# EAGLE design envca_4hp_2v (EAGLE 7.7.0)
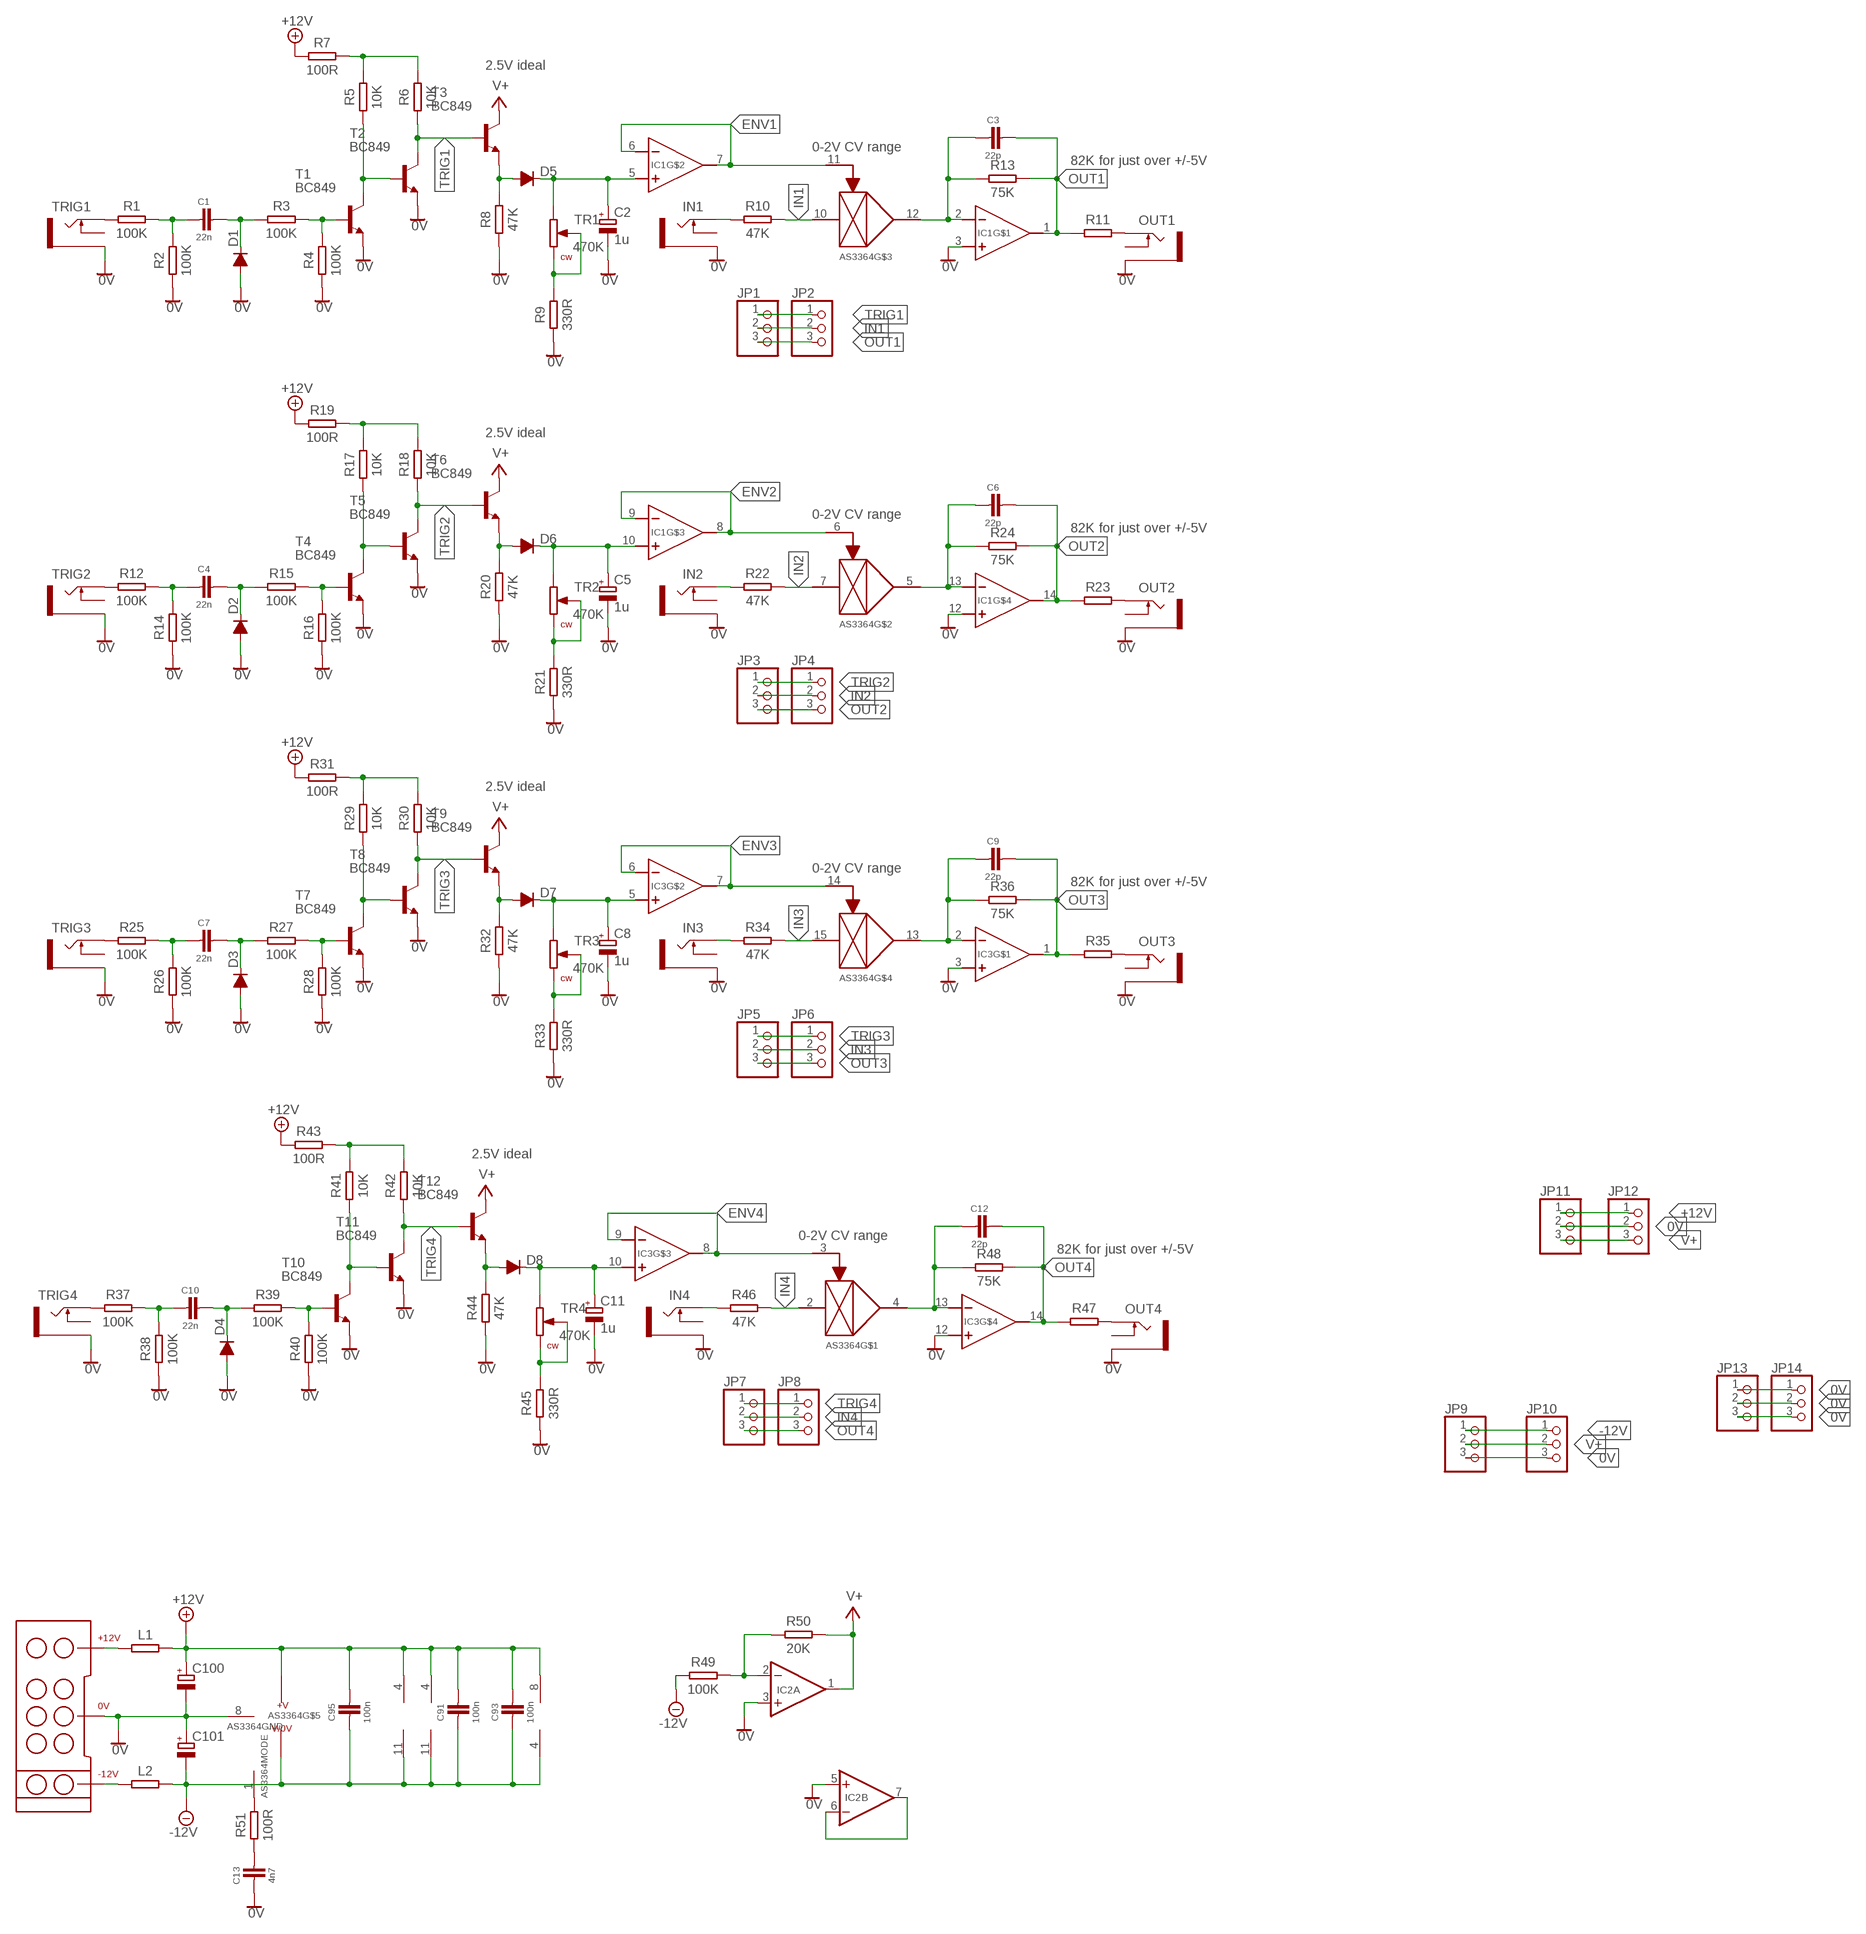
[diagram p0: schematic, sheet 1]

## Parts
AS3364  AS2164_SMD  [SO16]
C1  22n  CAP_0805  [C0805]
C2  1u  CPOL-EUE2.5-6  [E2,5-6]
C3  22p  CAP_0805  [C0805]
C4  22n  CAP_0805  [C0805]
C5  1u  CPOL-EUE2.5-6  [E2,5-6]
C6  22p  CAP_0805  [C0805]
C7  22n  CAP_0805  [C0805]
C8  1u  CPOL-EUE2.5-6  [E2,5-6]
C9  22p  CAP_0805  [C0805]
C10  22n  CAP_0805  [C0805]
C11  1u  CPOL-EUE2.5-6  [E2,5-6]
C12  22p  CAP_0805  [C0805]
C13  4n7  CAP_0805  [C0805]
C91  100n  CAP_0805  [C0805]
C93  100n  CAP_0805  [C0805]
C95  100n  CAP_0805  [C0805]
C100  CPOL-EUE2.5-6  [E2,5-6]
C101  CPOL-EUE2.5-6  [E2,5-6]
D1  DIODE-SOD123  [SOD123]
D2  DIODE-SOD123  [SOD123]
D3  DIODE-SOD123  [SOD123]
D4  DIODE-SOD123  [SOD123]
D5  DIODE-SOD123  [SOD123]
D6  DIODE-SOD123  [SOD123]
D7  DIODE-SOD123  [SOD123]
D8  DIODE-SOD123  [SOD123]
IC1  TL074_SO14  [SO14]
IC2  TL072_SMDD  [SO08]
IC3  TL074_SO14  [SO14]
IN1  THONKICONN  [THONKICONN]
IN2  THONKICONN  [THONKICONN]
IN3  THONKICONN  [THONKICONN]
IN4  THONKICONN  [THONKICONN]
JP1  PINHD-1X3  [1X03]
JP2  PINHD-1X3  [1X03]
JP3  PINHD-1X3  [1X03]
JP4  PINHD-1X3  [1X03]
JP5  PINHD-1X3  [1X03]
JP6  PINHD-1X3  [1X03]
JP7  PINHD-1X3  [1X03]
JP8  PINHD-1X3  [1X03]
JP9  PINHD-1X3  [1X03]
JP10  PINHD-1X3  [1X03]
JP11  PINHD-1X3  [1X03]
JP12  PINHD-1X3  [1X03]
JP13  PINHD-1X3  [1X03]
JP14  PINHD-1X3  [1X03]
L1  RESISTOR_0805  [R0805]
L2  RESISTOR_0805  [R0805]
OUT1  THONKICONN  [THONKICONN]
OUT2  THONKICONN  [THONKICONN]
OUT3  THONKICONN  [THONKICONN]
OUT4  THONKICONN  [THONKICONN]
R1  100K  RESISTOR_0805  [R0805]
R2  100K  RESISTOR_0805  [R0805]
R3  100K  RESISTOR_0805  [R0805]
R4  100K  RESISTOR_0805  [R0805]
R5  10K  RESISTOR_0805  [R0805]
R6  10K  RESISTOR_0805  [R0805]
R7  100R  RESISTOR_0805  [R0805]
R8  47K  RESISTOR_0805  [R0805]
R9  330R  RESISTOR_0805  [R0805]
R10  47K  RESISTOR_0805  [R0805]
R11  RESISTOR_0805  [R0805]
R12  100K  RESISTOR_0805  [R0805]
R13  75K  RESISTOR_0805  [R0805]
R14  100K  RESISTOR_0805  [R0805]
R15  100K  RESISTOR_0805  [R0805]
R16  100K  RESISTOR_0805  [R0805]
R17  10K  RESISTOR_0805  [R0805]
R18  10K  RESISTOR_0805  [R0805]
R19  100R  RESISTOR_0805  [R0805]
R20  47K  RESISTOR_0805  [R0805]
R21  330R  RESISTOR_0805  [R0805]
R22  47K  RESISTOR_0805  [R0805]
R23  RESISTOR_0805  [R0805]
R24  75K  RESISTOR_0805  [R0805]
R25  100K  RESISTOR_0805  [R0805]
R26  100K  RESISTOR_0805  [R0805]
R27  100K  RESISTOR_0805  [R0805]
R28  100K  RESISTOR_0805  [R0805]
R29  10K  RESISTOR_0805  [R0805]
R30  10K  RESISTOR_0805  [R0805]
R31  100R  RESISTOR_0805  [R0805]
R32  47K  RESISTOR_0805  [R0805]
R33  330R  RESISTOR_0805  [R0805]
R34  47K  RESISTOR_0805  [R0805]
R35  RESISTOR_0805  [R0805]
R36  75K  RESISTOR_0805  [R0805]
R37  100K  RESISTOR_0805  [R0805]
R38  100K  RESISTOR_0805  [R0805]
R39  100K  RESISTOR_0805  [R0805]
R40  100K  RESISTOR_0805  [R0805]
R41  10K  RESISTOR_0805  [R0805]
R42  10K  RESISTOR_0805  [R0805]
R43  100R  RESISTOR_0805  [R0805]
R44  47K  RESISTOR_0805  [R0805]
R45  330R  RESISTOR_0805  [R0805]
R46  47K  RESISTOR_0805  [R0805]
R47  RESISTOR_0805  [R0805]
R48  75K  RESISTOR_0805  [R0805]
R49  100K  RESISTOR_0805  [R0805]
R50  20K  RESISTOR_0805  [R0805]
R51  100R  RESISTOR_0805  [R0805]
T1  BC849  [SOT23]
T2  BC849  [SOT23]
T3  BC849  [SOT23]
T4  BC849  [SOT23]
T5  BC849  [SOT23]
T6  BC849  [SOT23]
T7  BC849  [SOT23]
T8  BC849  [SOT23]
T9  BC849  [SOT23]
T10  BC849  [SOT23]
T11  BC849  [SOT23]
T12  BC849  [SOT23]
TR1  470K  TRIMMER-3362  [TRIMMER3362]
TR2  470K  TRIMMER-3362  [TRIMMER3362]
TR3  470K  TRIMMER-3362  [TRIMMER3362]
TR4  470K  TRIMMER-3362  [TRIMMER3362]
TRIG1  THONKICONN  [THONKICONN]
TRIG2  THONKICONN  [THONKICONN]
TRIG3  THONKICONN  [THONKICONN]
TRIG4  THONKICONN  [THONKICONN]
U$1  EURO_POWER  [EURO_POWER]

## Nets
0V: AS3364.8 C2.- C5.- C8.- C11.- C13.1 C100.- C101.+ D1.A D2.A D3.A D4.A IC1.3(+) IC1.12(+) IC2.3(A:+IN) IC2.5(B:+IN) IC3.3(+) IC3.12(+) IN1.P$3_SLEEVE(SLEEVE) IN2.P$3_SLEEVE(SLEEVE) IN3.P$3_SLEEVE(SLEEVE) IN4.P$3_SLEEVE(SLEEVE) JP9.3 JP10.3 JP11.2 JP12.2 JP13.1 JP13.2 JP13.3 JP14.1 JP14.2 JP14.3 OUT1.P$3_SLEEVE(SLEEVE) OUT2.P$3_SLEEVE(SLEEVE) OUT3.P$3_SLEEVE(SLEEVE) OUT4.P$3_SLEEVE(SLEEVE) R2.1 R4.1 R8.1 R9.1 R14.1 R16.1 R20.1 R21.1 R26.1 R28.1 R32.1 R33.1 R38.1 R40.1 R44.1 R45.1 T1.2(E) T2.2(E) T4.2(E) T5.2(E) T7.2(E) T8.2(E) T10.2(E) T11.2(E) TRIG1.P$3_SLEEVE(SLEEVE) TRIG2.P$3_SLEEVE(SLEEVE) TRIG3.P$3_SLEEVE(SLEEVE) TRIG4.P$3_SLEEVE(SLEEVE) U$1.3(0V) U$1.4(0V) U$1.5(0V) U$1.6(0V) U$1.7(0V) U$1.8(0V)
+12V: AS3364.16(VDD) C91.2 C93.2 C95.2 C100.+ IC1.4(V+) IC2.8(P:V+) IC3.4(V+) JP11.1 JP12.1 L1.2 R7.1 R19.1 R31.1 R43.1
-12V: AS3364.9(VSS) C91.1 C93.1 C95.1 C101.- IC1.11(V-) IC2.4(P:V-) IC3.11(V-) JP9.1 JP10.1 L2.2 R49.1
ENV1: AS3364.11(VC) IC1.6(-) IC1.7(OUT)
ENV2: AS3364.6(VC) IC1.8(OUT) IC1.9(-)
ENV3: AS3364.14(VC) IC3.6(-) IC3.7(OUT)
ENV4: AS3364.3(VC) IC3.8(OUT) IC3.9(-)
IN1: AS3364.10(IN) JP1.2 JP2.2 R10.2
IN2: AS3364.7(IN) JP3.2 JP4.2 R22.2
IN3: AS3364.15(IN) JP5.2 JP6.2 R34.2
IN4: AS3364.2(IN) JP7.2 JP8.2 R46.2
N$1: L1.1 U$1.9(+12V) U$1.10(+12V)
N$2: L2.1 U$1.1(-12V) U$1.2(-12V)
N$3: IN1.P$1_TIP(TIP) R10.1
N$4: C2.+ D5.C IC1.5(+) TR1.P$1
N$5: R5.1 T1.3(C) T2.1(B)
N$6: C1.2 D1.C R3.1
N$7: R3.2 R4.2 T1.1(B)
N$8: C1.1 R1.2 R2.2
N$9: R5.2 R6.2 R7.2
N$10: R9.2 TR1.P$2A TR1.P$2B TR1.P$3
N$11: OUT1.P$1_TIP(TIP) R11.2
N$12: R1.1 TRIG1.P$1_TIP(TIP)
N$13: C5.+ D6.C IC1.10(+) TR2.P$1
N$14: AS3364.12(OUT) C3.1 IC1.2(-) R13.1
N$15: R17.1 T4.3(C) T5.1(B)
N$16: C8.+ D7.C IC3.5(+) TR3.P$1
N$17: C4.2 D2.C R15.1
N$18: R15.2 R16.2 T4.1(B)
N$19: C4.1 R12.2 R14.2
N$20: R17.2 R18.2 R19.2
N$21: R21.2 TR2.P$2A TR2.P$2B TR2.P$3
N$22: R12.1 TRIG2.P$1_TIP(TIP)
N$23: IN2.P$1_TIP(TIP) R22.1
N$24: OUT2.P$1_TIP(TIP) R23.2
N$25: AS3364.5(OUT) C6.1 IC1.13(-) R24.1
N$26: R29.1 T7.3(C) T8.1(B)
N$27: C7.2 D3.C R27.1
N$28: R27.2 R28.2 T7.1(B)
N$29: C7.1 R25.2 R26.2
N$30: R29.2 R30.2 R31.2
N$31: R33.2 TR3.P$2A TR3.P$2B TR3.P$3
N$32: R25.1 TRIG3.P$1_TIP(TIP)
N$33: IN3.P$1_TIP(TIP) R34.1
N$34: OUT3.P$1_TIP(TIP) R35.2
N$35: AS3364.13(OUT) C9.1 IC3.2(-) R36.1
N$36: C11.+ D8.C IC3.10(+) TR4.P$1
N$37: R41.1 T10.3(C) T11.1(B)
N$38: C10.2 D4.C R39.1
N$39: R39.2 R40.2 T10.1(B)
N$40: C10.1 R37.2 R38.2
N$41: R41.2 R42.2 R43.2
N$42: R45.2 TR4.P$2A TR4.P$2B TR4.P$3
N$43: R37.1 TRIG4.P$1_TIP(TIP)
N$44: IN4.P$1_TIP(TIP) R46.1
N$45: OUT4.P$1_TIP(TIP) R47.2
N$46: AS3364.4(OUT) C12.1 IC3.13(-) R48.1
N$47: IC2.2(A:-IN) R49.2 R50.1
N$48: IC2.6(B:-IN) IC2.7(B:OUT)
N$49: D5.A R8.2 T3.2(E)
N$50: D6.A R20.2 T6.2(E)
N$51: D7.A R32.2 T9.2(E)
N$52: D8.A R44.2 T12.2(E)
N$53: AS3364.1 R51.2
N$54: C13.2 R51.1
OUT1: C3.2 IC1.1(OUT) JP1.3 JP2.3 R11.1 R13.2
OUT2: C6.2 IC1.14(OUT) JP3.3 JP4.3 R23.1 R24.2
OUT3: C9.2 IC3.1(OUT) JP5.3 JP6.3 R35.1 R36.2
OUT4: C12.2 IC3.14(OUT) JP7.3 JP8.3 R47.1 R48.2
TRIG1: JP1.1 JP2.1 R6.1 T2.3(C) T3.1(B)
TRIG2: JP3.1 JP4.1 R18.1 T5.3(C) T6.1(B)
TRIG3: JP5.1 JP6.1 R30.1 T8.3(C) T9.1(B)
TRIG4: JP7.1 JP8.1 R42.1 T11.3(C) T12.1(B)
V+: IC2.1(A:OUT) JP9.2 JP10.2 JP11.3 JP12.3 R50.2 T3.3(C) T6.3(C) T9.3(C) T12.3(C)
Unconnected: IN1.P$2_SWITCH(SWITCH) IN2.P$2_SWITCH(SWITCH) IN3.P$2_SWITCH(SWITCH) IN4.P$2_SWITCH(SWITCH) OUT1.P$2_SWITCH(SWITCH) OUT2.P$2_SWITCH(SWITCH) OUT3.P$2_SWITCH(SWITCH) OUT4.P$2_SWITCH(SWITCH) TRIG1.P$2_SWITCH(SWITCH) TRIG2.P$2_SWITCH(SWITCH) TRIG3.P$2_SWITCH(SWITCH) TRIG4.P$2_SWITCH(SWITCH)

## Notes on the sheet
- 2.5V ideal
- 0-2V CV range
- 82K for just over +/-5V
- 2.5V ideal
- 0-2V CV range
- 82K for just over +/-5V
- 2.5V ideal
- 0-2V CV range
- 82K for just over +/-5V
- 2.5V ideal
- 0-2V CV range
- 82K for just over +/-5V

## Library data of the parts
AS3364 = ay_x:AS2164_SMD
C1 C3 C4 C6 C7 C9 C10 C12 C13 C91 C93 C95 = ay_x:CAP_0805
C2 C5 C8 C11 C100 C101 = resistor:CPOL-EU: POLARIZED CAPACITOR, European symbol
D1-D8 = ay_x:DIODE-: DIODE
IC1 IC3 = ay_x:TL074_SO14
IC2 = ay_x:TL072_SMD: OP AMP
IN1-IN4 OUT1-OUT4 TRIG1-TRIG4 = ay_x:THONKICONN
JP1-JP14 = pinhead:PINHD-1X3: PIN HEADER
L1 L2 R1-R51 = ay_x:RESISTOR_0805
T1-T12 = transistor-neu-to92:BC849: NPN TRANSISTOR
TR1-TR4 = ay_x:TRIMMER-3362
U$1 = ay_x:EURO_POWER

## Board
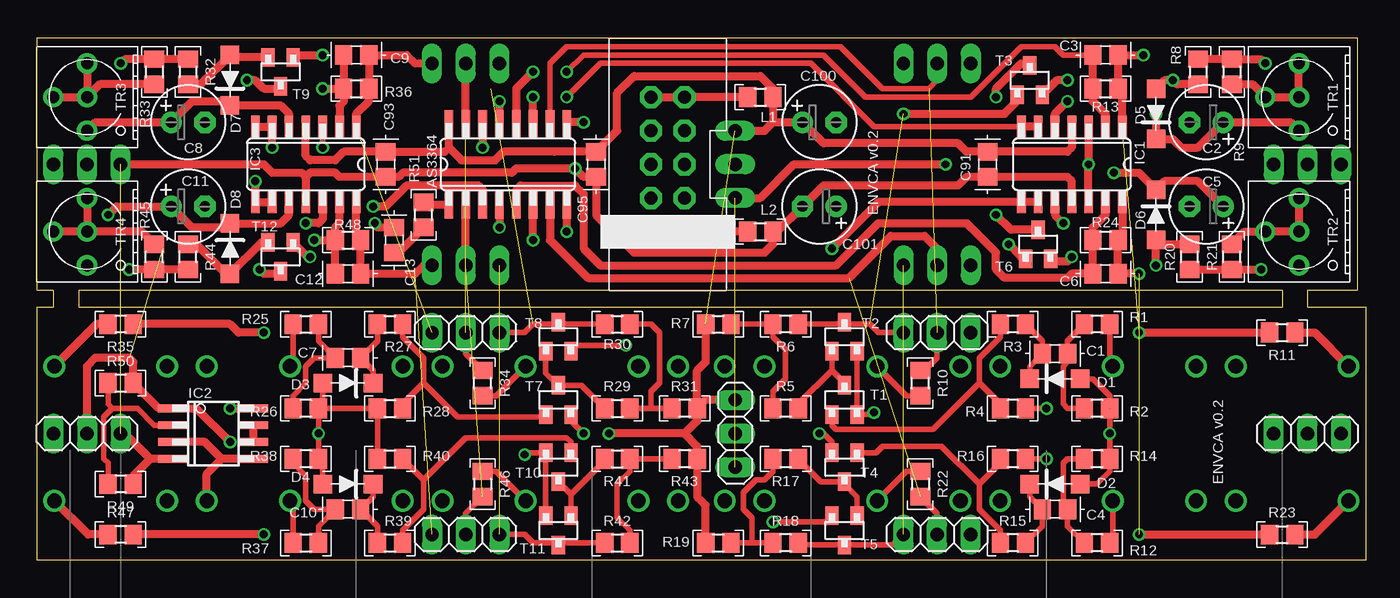
[diagram p1: board, top side]
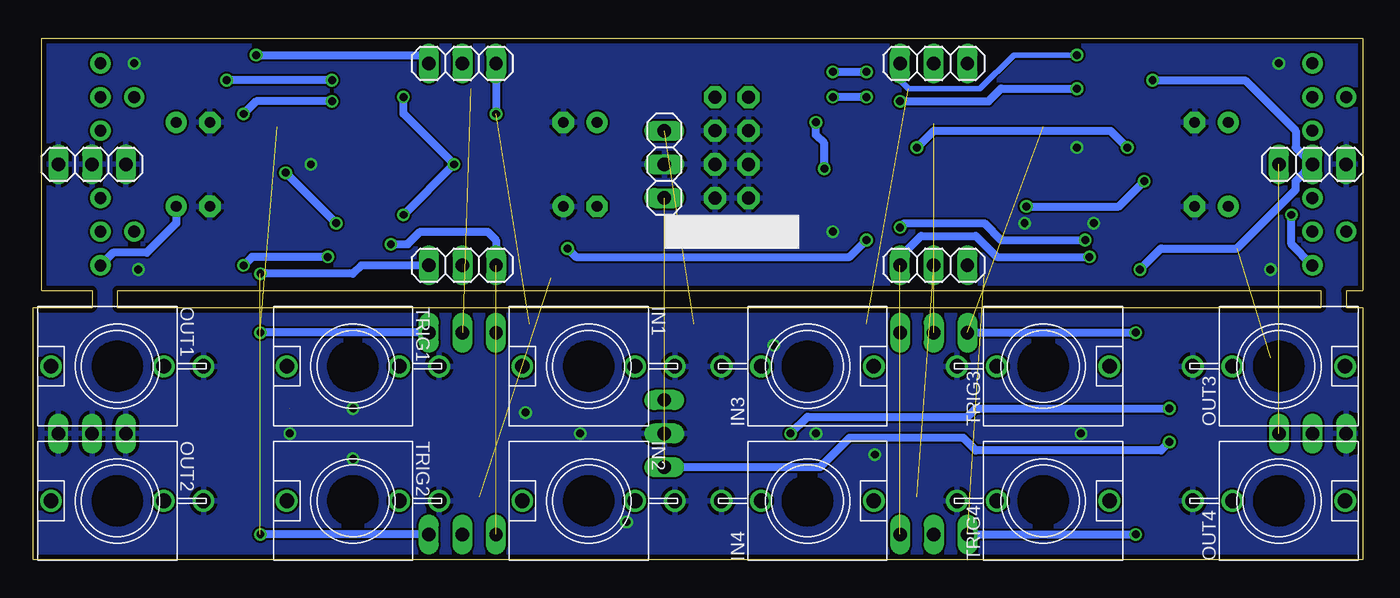
[diagram p2: board, bottom side, seen from below]

Size 100.33 x 39.37 mm. Coordinates in mm from the lower left corner, seen from the top.
Outline: 0,0 100.33,0 100.33,19.05 95.88,19.05 95.88,20.32 99.69,20.32 99.69,39.37 0,39.37 0,20.32 1.27,20.32 1.27,19.05 0,19.05 0,0
Outline: 93.98,19.05 3.17,19.05 3.17,20.32 93.98,20.32 93.98,19.05
Copper layers (1*16): Top 0.0356mm / dielectric 1.5011mm / Bottom 0.0356mm
Design rules "LaenPCBOrder": minimum track width 6mil, minimum drill 13mil, track to track 6mil, track to pad 6mil, pad to pad 6mil, via to via 6mil, smd to smd 6mil, copper to edge 15mil, drill to drill 6mil, minimum pad ring 7mil, minimum via ring 7mil, stop-mask expansion 3mil, vias tented up to drill 0mil, thermal gap 10mil

### Footprints (pad centres in the part's own frame; a part is rotated, then mirrored left to right if it is on the bottom)
SO16 = smd 0.66 x 2.032: 1 -3.81,-3.073; 2 -2.54,-3.073; 3 -1.27,-3.073; 4 0,-3.073; 5 1.27,-3.073; 6 2.54,-3.073; 7 3.81,-3.073; 8 5.08,-3.073; 9 5.08,3.073; 10 3.81,3.073; 11 2.54,3.073; 12 1.27,3.073; 13 0,3.073; 14 -1.27,3.073; 15 -2.54,3.073; 16 -3.81,3.073
C0805 = smd 1.3 x 1.5: 1 -0.95,0; 2 0.95,0
E2,5-6 = drill 0.813 pad 1.6: + -1.27,0 | drill 0.813 pad 1.6 octagon: - 1.27,0
SOD123 = smd 1.4 x 1.4: A 1.9,0; C -1.9,0
SO14 = smd 0.66 x 1.651: 1 -3.81,-2.857; 2 -2.54,-2.857; 3 -1.27,-2.857; 4 0,-2.857; 5 1.27,-2.857; 6 2.54,-2.857; 7 3.81,-2.857; 8 3.81,2.857; 9 2.54,2.857; 10 1.27,2.857; 11 0,2.857; 12 -1.27,2.857; 13 -2.54,2.857; 14 -3.81,2.857
SO08 = smd 0.6 x 2.2: 1 -1.905,-3.048; 2 -0.635,-3.048; 3 0.635,-3.048; 4 1.905,-3.048; 5 1.905,3.048; 6 0.635,3.048; 7 -0.635,3.048; 8 -1.905,3.048
THONKICONN = drill 1.1: P$1_TIP 0,5; P$2_SWITCH 0,-3.5; P$3_SLEEVE 0,-6.5
1X03 = drill 1.016 long: 1 -2.54,0; 2 0,0; 3 2.54,0
R0805 = smd 1.3 x 1.5: 1 -0.95,0; 2 0.95,0
SOT23 = smd 1 x 1.4: 1 -0.95,-1.1; 2 0.95,-1.1; 3 0,1.1
TRIMMER3362 = drill 0.9 pad 1.524: P$1 -2.54,0; P$2A 0,0; P$2B 0,2.54; P$3 2.54,0
EURO_POWER = drill 1 pad 1.676 octagon: 1 -5.08,1.27; 2 -5.08,-1.27; 3 -2.54,1.27; 4 -2.54,-1.27; 5 0,1.27; 6 0,-1.27; 7 2.54,1.27; 8 2.54,-1.27; 9 5.08,1.27; 10 5.08,-1.27

### Placement (x,y rotation side)
AS3364  34.93,29.84 0 top
C1  76.83,15.56 180 top
C2  88.27,33.02 180 top
C3  80.64,38.1 0 top
C4  76.83,3.81 180 top
C5  88.27,26.67 180 top
C6  80.64,21.59 0 top
C7  23.5,15.24 0 top
C8  11.43,33.02 0 top
C9  24.13,38.1 0 top
C10  23.5,3.81 0 top
C11  11.43,26.67 0 top
C12  23.5,21.59 0 top
C13  26.99,24.13 270 top
C91  71.75,29.84 90 top
C93  26.35,29.84 90 top
C95  42.23,29.84 90 top
C100  59.05,33.02 0 top
C101  59.05,26.67 180 top
D1  76.83,13.65 0 top
D2  76.83,5.71 0 top
D3  23.5,13.34 180 top
D4  23.5,5.71 180 top
D5  84.45,33.66 90 top
D6  84.45,26.04 270 top
D7  14.61,36.2 90 top
D8  14.61,23.49 270 top
IC1  78.1,29.84 180 top
IC2  13.33,9.53 270 top
IC3  20.32,29.84 180 top
IN1  58.42,14.61 90 bottom
IN2  58.42,4.45 90 bottom
IN3  41.91,14.61 270 bottom
IN4  41.91,4.45 270 bottom
JP1  67.94,17.14 0 top
JP2  67.94,37.47 180 bottom
JP3  67.94,1.91 0 top
JP4  67.94,22.22 180 bottom
JP5  32.38,17.14 180 top
JP6  32.38,37.47 0 bottom
JP7  32.38,1.91 180 top
JP8  32.38,22.22 0 bottom
JP9  3.81,9.53 180 top
JP10  3.81,29.84 0 bottom
JP11  52.71,9.53 270 top
JP12  52.71,29.84 270 bottom
JP13  95.88,9.53 0 top
JP14  95.88,29.84 180 bottom
L1  54.61,34.93 0 top
L2  54.61,24.76 0 top
OUT1  93.98,14.61 90 bottom
OUT2  93.98,4.45 90 bottom
OUT3  6.35,14.61 270 bottom
OUT4  6.35,4.45 270 bottom
R1  80.01,17.78 180 top
R2  80.01,11.43 180 top
R3  73.66,17.78 180 top
R4  73.66,11.43 180 top
R5  56.52,11.43 180 top
R6  56.52,17.78 180 top
R7  51.44,17.78 0 top
R8  87.63,36.83 270 top
R9  90.17,36.83 270 top
R10  66.67,13.34 90 top
R11  93.98,17.14 0 top
R12  80.01,1.27 180 top
R13  80.64,35.56 0 top
R14  80.01,7.62 180 top
R15  73.66,1.27 180 top
R16  73.66,7.62 180 top
R17  56.52,7.62 180 top
R18  56.52,1.27 180 top
R19  51.44,1.27 0 top
R20  86.99,22.86 90 top
R21  90.17,22.86 90 top
R22  66.67,5.71 270 top
R23  93.98,1.91 0 top
R24  80.64,24.13 0 top
R25  20.32,17.78 0 top
R26  20.32,11.43 180 top
R27  26.67,17.78 0 top
R28  26.67,11.43 0 top
R29  43.82,11.43 0 top
R30  43.82,17.78 0 top
R31  48.9,11.43 180 top
R32  11.43,36.83 270 top
R33  8.89,36.83 270 top
R34  33.66,13.34 90 top
R35  6.35,17.78 180 top
R36  24.13,35.56 0 top
R37  20.32,1.27 0 top
R38  20.32,7.62 180 top
R39  26.67,1.27 0 top
R40  26.67,7.62 0 top
R41  43.82,7.62 0 top
R42  43.82,1.27 0 top
R43  48.9,7.62 180 top
R44  11.43,22.86 90 top
R45  8.89,22.86 90 top
R46  33.66,5.71 270 top
R47  6.35,1.91 180 top
R48  23.5,24.13 0 top
R49  6.35,5.71 180 top
R50  6.35,13.34 0 top
R51  29.21,26.04 90 top
T1  60.96,12.06 0 top
T2  60.96,16.83 0 top
T3  74.93,36.2 0 top
T4  60.96,6.99 180 top
T5  60.96,2.22 180 top
T6  75.56,23.81 0 top
T7  39.37,12.06 0 top
T8  39.37,16.83 0 top
T9  18.41,36.83 180 top
T10  39.37,6.99 180 top
T11  39.37,2.22 180 top
T12  18.41,22.86 180 top
TR1  95.25,34.93 90 top
TR2  95.25,24.76 90 top
TR3  3.81,34.93 90 top
TR4  3.81,24.76 90 top
TRIG1  76.2,14.61 90 bottom
TRIG2  76.2,4.45 90 bottom
TRIG3  24.13,14.61 270 bottom
TRIG4  24.13,4.45 270 bottom
U$1  47.62,29.84 90 top

### Tracks (layer width: path | path; a pad name or v marks a point on that pad's centre or on a via)
0V  (via drill 0.6)  (1 unrouted)
  Top 0.406: R4.1 v76.2,11.43 | D1.A 79.69,13.65 80.96,12.38 R2.1 | T2.2 T1.2 63.01,10.96 v63.18,11.11 | R16.1 v76.2,7.62 | D2.A 80.01,5.71 80.96,6.67 R14.1 v80.96,9.52 v80.96,9.53 R2.1 | T4.2 60.01,8.89 59.38,9.52 v59.06,9.52 v59.05,9.53 | R26.1 R28.1 R40.1 | D3.A 21.59,11.76 R26.1 | T7.2 40.32,10.48 v41.28,9.53 | T11.2 T10.2 37,8.09 v36.83,7.94 | R26.1 v21.27,9.53 21.27,8.89 R38.1 21.59,7.93 D4.A | T8.2 40.15,15.73 40.64,16.19 v44.45,16.19 | IC3.3 v21.59,31.11 | v55.56,2.86 59.55,2.86 T5.2
  Top 0.61: R44.1 R45.1 8.57,21.91 v6.98,21.91 | IC3.12 21.59,25.72 21.27,25.4 v20.32,25.4 | R8.1 R9.1 92.39,37.78 v92.71,37.47 | v6.35,37.47 6.66,37.78 R33.1 R32.1 | v92.39,21.91 90.49,21.91 R21.1 R20.1 | IC1.3 v79.38,29.84 IC1.12 | AS3364.8 v40.01,24.76 | IC2.5 13.97,7.62 | 13.97,7.62 12.7,8.89 IC2.3 | OUT4.P$3_SLEEVE 12.85,6.5 13.97,7.62 | C13.1 25.72,25.08 v25.53,25.4
  pour Bottom: 0,40.01 0,-0.64 100.33,-0.64 100.33,40.01
+12V  (via drill 0.6)  (1 unrouted)
  Top 0.406: 55.56,35.24 55.56,35.56 | C91.2
  Top 0.61: R7.1 50.49,14.93 49.85,14.29 R31.1 | R19.1 50.49,4.12 50.17,4.45 49.85,4.76 R43.1 49.85,8.58 48.9,9.53 | IC3.4 20.32,30.48 20.64,30.16 22.54,30.16 23.18,30.8 C93.2 27.31,30.79 29.84,30.8 30.79,30.79 31.11,31.11 | 31.11,31.11 AS3364.16 | 31.11,31.11 32.07,30.16 34.61,30.16 35.24,30.8 39.05,30.79 C95.2 43.82,32.39 43.82,35.24 45.09,36.51 54.61,36.51 55.56,35.56 | JP11.1 50.48,12.06 R31.1 | 55.56,33.02 L1.2 55.56,35.24 | 55.56,33.02 C100.+ 59.37,31.43 69.53,31.43 70.17,30.8 C91.2 77.79,30.8 78.1,31.11 IC1.4 | JP12.1 54.92,32.39 55.56,33.02 | R31.1 49.85,10.47 48.9,9.53 | 48.9,9.53 v43.18,9.53 | v14.61,11.43 IC2.8
  Bottom 0.61: v43.18,9.53 41.91,10.79 29.84,10.79 29.21,11.43 v14.61,11.43
-12V  (via drill 0.6)  (1 unrouted)
  Top 0.406: C91.1 | 40.11,33.02 AS3364.9
  Top 0.61: 20.32,28.89 20.64,29.21 22.54,29.21 22.86,28.89 C93.1 27.3,28.89 27.62,29.21 35.88,29.21 36.2,29.53 v40.64,29.53 41.28,28.89 C95.1 42.23,26.04 45.09,23.18 54.93,23.18 55.56,23.81 55.56,24.44 L2.2 55.88,24.76 C101.- 59.37,28.26 69.53,28.26 70.17,28.89 C91.1 77.79,28.89 78.1,28.57 IC1.11 | 20.32,28.89 IC3.11 | v41.28,33.02 40.11,33.02 | IC2.4 8.57,7.62 | 8.57,7.62 7.94,6.99 7.3,6.35 R49.1 | JP9.1 6.66,9.53 8.57,7.62 | JP10.1 17.14,29.84 17.78,29.21 20,29.21 20.32,28.89
  Bottom 0.61: v40.64,29.53 40.64,31.43 41.28,32.07 v41.28,33.02
ENV1  (via drill 0.6)
  Top 0.406: IC1.7 63.18,32.7 58.42,37.47 42.55,37.47 v40.01,34.93
  Top 0.61: IC1.6 IC1.7 | AS3364.11 v37.47,34.93
  Bottom 0.61: v37.47,34.93 v40.01,34.93
ENV2  (via drill 0.6)
  Top 0.61: IC1.9 IC1.8 63.5,26.99 v60.01,23.49 | v37.47,24.13 AS3364.6
  Bottom 0.61: v60.01,23.49 59.37,22.86 38.74,22.86 v37.47,24.13
ENV3  (via drill 0.6)
  Top 0.61: IC3.7 IC3.6 v17.78,31.11 | AS3364.14 v33.66,31.11
  Bottom 0.61: v33.66,31.11 32.38,32.39 19.05,32.39 v17.78,31.11
ENV4  (via drill 0.6)
  Top 0.61: IC3.9 IC3.8 v16.51,28.57 | AS3364.3 33.66,27.94 33.34,28.26 27.94,28.26 26.35,26.67 v25.4,26.67
  Bottom 0.61: v25.4,26.67 18.41,26.67 v16.51,28.57
IN1  (1 unrouted)
  Top 0.406: R10.2 66.99,14.29 67.94,15.24 JP1.2 | JP2.2 67.94,36.2 67.31,35.56 63.82,35.56 60.64,38.73 40.01,38.73 38.74,37.47 AS3364.10
IN2  (1 unrouted)
  Top 0.406: JP3.2 67.94,3.5 R22.2
  Top 0.61: AS3364.7 38.74,24.13 41.59,21.27 61.28,21.27 64.45,24.45 66.99,24.45 67.94,23.49 JP4.2
IN3  (1 unrouted)
  Top 0.406: JP5.2 32.38,15.56 R34.2
  Top 0.61: AS3364.15 JP6.2
IN4  (1 unrouted)
  Top 0.406: JP7.2 32.38,3.5 R46.2
  Top 0.61: JP8.2 AS3364.2
N$1
  Top 0.61: U$1.9 U$1.10 50.16,34.92 L1.1
N$2
  Top 0.61: U$1.1 U$1.2 50.16,24.77 L2.1
N$3
  Top 0.406: R10.1 65.64,12.38 IN1.P$1_TIP
N$4  (via drill 0.6)
  Top 0.61: TR1.P$1 94.61,33.02 C2.+ 87.63,31.11 86.36,31.11 85.72,31.75 D5.C v84.45,33.66 | IC1.5 76.83,33.66 v77.79,34.61
  Bottom 0.61: v77.79,34.61 83.5,34.61 v84.45,33.66
N$5
  Top 0.406: R5.1 57.47,11.75 60.01,14.29 | T2.1 60.01,14.29 | 60.01,14.29 60.64,13.65 60.64,13.48 T1.3
N$6
  Top 0.406: R3.1 75.88,16.5 C1.2 74.94,14.61 D1.C
N$7
  Top 0.406: R4.2 72.71,11.75 71.12,13.34 | 71.12,13.34 71.12,15.24 72.07,16.19 72.71,16.83 R3.2 | T1.1 60.01,10.16 60.32,9.85 67.63,9.85 71.12,13.34
N$8
  Top 0.406: R1.2 77.78,16.5 C1.1 77.78,14.92 77.47,14.61 77.47,11.75 77.79,11.43 R2.2
N$9
  Top 0.406: 55.57,11.75 R5.2 55.56,12.7 56.52,13.65 56.52,15.88 55.57,16.82 R6.2 R7.2
N$10
  Top 0.61: TR1.P$3 TR1.P$2A TR1.P$2B 91.75,35.88 R9.2
N$11
  Top 0.61: R11.2 96.44,17.14 OUT1.P$1_TIP
N$12
  Top 0.406: TRIG1.P$1_TIP 80.96,14.61 R1.1
N$13  (via drill 0.6)
  Top 0.61: C5.+ 87.63,28.57 85.09,28.57 D6.C 83.18,29.21 v81.28,29.21 | IC1.10 76.83,26.04 v77.47,25.4
  Bottom 0.61: v77.47,25.4 v81.28,29.21 | C5.+ 89.53,25.4 91.76,23.18 94.3,23.18 TR2.P$1
N$14  (via drill 0.6)
  Top 0.406: C3.1 77.47,38.1 76.83,38.73 74.3,38.73 70.48,34.93 62.55,34.93 59.37,38.1 41.28,38.1 v40.01,36.83
  Top 0.61: IC1.2 80.64,33.66 79.69,34.61 R13.1 C3.1 | v37.47,36.83 36.2,35.56 AS3364.12
  Bottom 0.61: v40.01,36.83 v37.47,36.83
N$15
  Top 0.406: T5.1 61.91,4.77 60.96,5.71 61.13,5.71 T4.3 59.2,5.88 R17.1
N$16
  Top 0.406: D7.C
  Top 0.61: TR3.P$1 4.45,33.02 C8.+ 11.75,34.61 14.29,34.61 D7.C | D7.C 18.41,34.3 19.05,33.66 IC3.5
N$17
  Top 0.406: R15.1 75.88,2.54 C4.2 74.94,4.76 D2.C
N$18
  Top 0.406: 71.12,5.71 71.12,3.81 72.71,2.22 R15.2 | 71.12,5.71 72.71,7.3 R16.2 | T4.1 63.33,8.09 63.82,8.57 68.26,8.57 71.12,5.71
N$19
  Top 0.406: R12.2 77.79,2.54 C4.1 77.47,4.12 77.47,7.3 77.79,7.62 R14.2
N$20
  Top 0.406: R19.2 53.98,1.27 | 53.98,1.27 R18.2 | R17.2 55.57,6.67 54.93,6.03 54.29,6.03 53.34,5.08 53.34,3.81 53.98,3.17 53.98,1.27
N$21
  Top 0.61: TR2.P$3 TR2.P$2A TR2.P$2B 91.12,24.76 R21.2
N$22
  Top 0.406: TRIG2.P$1_TIP 81.2,1.51 R12.1
N$23
  Top 0.406: R22.1 65.64,6.67 IN2.P$1_TIP
N$24
  Top 0.61: R23.2 96.44,1.91 OUT2.P$1_TIP
N$25
  Top 0.61: IC1.13 80.64,26.04 79.69,25.08 R24.1 C6.1 78.1,21.59 77.79,21.27 73.02,21.27 72.39,21.91 72.39,23.18 70.17,25.4 63.5,25.4 60.33,22.22 42.55,22.22 41.28,23.49 41.28,27.62 40.64,28.26 36.51,28.26 36.2,27.94 AS3364.5
N$26
  Top 0.406: T8.1 38.42,14.12 T7.3 41.13,13.17 R29.1
N$27
  Top 0.406: D3.C 25.39,14.29 C7.2 25.72,16.51 R27.1
N$28
  Top 0.406: R28.2 27.94,12.06 29.21,13.34 | 29.21,13.34 29.21,15.24 27.62,16.83 R27.2 | 29.21,13.34 31.75,10.79 38.25,10.79 T7.1
N$29
  Top 0.406: R25.2 21.27,16.51 C7.1 20.95,15.24 20.32,14.61 20.32,13.34 19.37,12.38 R26.2
N$30
  Top 0.406: R29.2 46.36,11.43 | 46.36,11.43 R31.2 | R30.2 46.36,17.78 46.99,17.14 46.99,13.34 46.36,12.7 46.36,11.43
N$31
  Top 0.61: TR3.P$3 TR3.P$2A | TR3.P$2B TR3.P$2A | R33.2 4.77,35.88 TR3.P$2A
N$32
  Top 0.406: R25.1 19.37,14.85 TRIG3.P$1_TIP
N$33
  Top 0.406: R34.1 34.69,12.38 IN3.P$1_TIP
N$34
  Top 0.61: R35.2 4.53,17.78 OUT3.P$1_TIP
N$35  (via drill 0.6)
  Top 0.61: C9.1 R36.1 | R36.1 23.18,34.61 22.86,34.29 IC3.2 | AS3364.13 v34.93,34.61 | v21.59,35.56 R36.1
  Bottom 0.61: v34.93,34.61 28.26,34.61 27.3,35.56 v21.59,35.56
N$36  (via drill 0.6)
  Top 0.61: IC3.10 19.05,26.04 18.41,25.39 D8.C 14.29,25.08 11.75,25.08 C11.+ 6.03,26.67 v5.4,26.04
  Bottom 0.61: TR4.P$1 5.4,23.81 v5.4,26.04
N$37
  Top 0.406: T11.1 40.32,4.94 | 40.32,4.94 T10.3 | R41.1 42.87,7.48 40.32,4.94
N$38
  Top 0.406: R39.1 25.72,2.54 C10.2 25.39,4.76 D4.C
N$39
  Top 0.406: T10.1 40.32,8.89 40.01,9.21 32.38,9.21 29.21,6.03 | R39.2 27.62,2.22 29.21,3.81 29.21,6.03 | 29.21,6.03 R40.2
N$40
  Top 0.406: R37.2 21.27,2.54 C10.1 20.95,3.81 20.32,4.45 20.32,6.35 19.37,7.3 R38.2
N$41
  Top 0.406: R43.2 R41.2 44.77,6.67 43.82,5.71 43.82,3.17 44.77,2.22 R42.2
N$42
  Top 0.61: TR4.P$3 TR4.P$2A | TR4.P$2A TR4.P$2B | R45.2 7.94,24.76 TR4.P$2A
N$43
  Top 0.406: R37.1 19.37,4.21 TRIG4.P$1_TIP
N$44
  Top 0.406: R46.1 34.69,6.67 IN4.P$1_TIP
N$45
  Top 0.61: R47.2 3.89,1.91 OUT4.P$1_TIP
N$46  (via drill 0.6)
  Top 0.61: R48.1 22.54,25.08 22.86,25.4 IC3.13 | C12.1 R48.1 | AS3364.4 v34.93,25.08 | v20.95,24.13 R48.1
  Bottom 0.61: v34.93,25.08 34.61,25.4 28.57,25.4 27.3,24.13 v20.95,24.13
N$47
  Top 0.406: IC2.2 8.89,10.16 7.62,11.43 5.71,11.43 | R49.2 5.4,7.3 5.08,7.62 5.08,10.79 5.71,11.43 | R50.1 5.4,11.75 5.71,11.43
N$48
  Top 0.61: IC2.6 IC2.7
N$49  (via drill 0.6)
  Top 0.61: D5.A 85.09,36.2 v85.72,36.2 86.04,35.88 R8.2 | v77.79,36.2 76.98,36.2 T3.2
  Bottom 0.61: v77.79,36.2 v85.72,36.2
N$50  (via drill 0.6)
  Top 0.406: 84.77,23.81 D6.A | T6.2 76.52,22.54
  Top 0.61: R20.2 84.77,23.81 | 76.52,22.54 77.79,22.54 v78.1,22.86 | v84.45,22.22 D6.A
  Bottom 0.61: v78.1,22.86 83.82,22.86 v84.45,22.22
N$51
  Top 0.406: 14.77,37.93 D7.A
  Top 0.61: R32.2 12.39,35.88 D7.A | T9.2 14.77,37.93
N$52
  Top 0.406: 14.29,21.59 D8.A
  Top 0.61: R44.2 12.07,23.81 14.29,21.59 | T12.2 16.97,23.96 D8.A
N$53
  Top 0.61: AS3364.1 29.42,26.77 R51.2
N$54
  Top 0.61: C13.2 27.3,23.18 R51.1
OUT1  (via drill 0.6)  (1 unrouted)
  Top 0.61: v83.19,17.14 R11.1 | IC1.1 81.91,35.25 R13.2 C3.2 v83.5,38.1
  Bottom 0.61: JP1.3 v83.19,17.14 | v83.5,38.1 71.12,38.1 JP2.3
OUT2  (via drill 0.6)  (1 unrouted)
  Top 0.406: 81.91,24.44 R24.2
  Top 0.61: v83.19,1.91 R23.1 | R24.2 C6.2 v83.19,21.59 | IC1.14 81.91,24.44
  Bottom 0.61: JP3.3 v83.19,1.91 | JP4.3 75.56,22.22 76.2,21.59 v83.19,21.59
OUT3  (via drill 0.6)  (1 unrouted)
  Top 0.406: 28.57,37.47 28.89,37.47
  Top 0.61: v17.14,17.14 15.24,17.14 14.61,17.78 R35.1 | IC3.1 24.13,33.66 25.08,34.61 R36.2 C9.2 27.94,38.1 28.57,37.47 | 28.89,37.47 JP6.3
  Bottom 0.61: JP5.3 v17.14,17.14
OUT4  (via drill 0.6)  (1 unrouted)
  Top 0.61: v17.14,1.91 R47.1 | IC3.14 24.13,24.45 R48.2 C12.2 28.57,21.59 29.21,22.22 JP8.3
  Bottom 0.61: JP7.3 v17.14,1.91
TRIG1  (via drill 0.6)  (1 unrouted)
  Top 0.406: T2.3 60.64,17.78 | 60.64,17.78 R6.1 | 60.64,17.78 62.87,17.78 63.5,17.14 JP1.1 | 73.98,34.61 T3.1
  Top 0.61: v65.41,33.66 73.02,33.66 73.98,34.61
  Bottom 0.61: JP2.1 v65.41,33.66
TRIG2  (via drill 0.6)  (1 unrouted)
  Top 0.406: R18.1 57.61,1.12 T5.3 64.62,1.12 JP3.1 | T6.1 74.29,22.86
  Top 0.61: 74.29,22.86 v73.34,23.81
  Bottom 0.61: v73.34,23.81 72.07,23.81 71.12,24.76 66.04,24.76 65.41,24.13 JP4.1
TRIG3  (via drill 0.6)  (1 unrouted)
  Top 0.406: R30.1 39.54,17.78 T8.3 39.2,17.78 37.47,17.78 36.83,17.14 JP5.1 | T9.1 19.69,38.1
  Top 0.61: 19.69,38.1 v21.59,38.1
  Bottom 0.406: v21.59,38.1 26.35,38.1 28.89,35.56 34.29,35.56 34.93,36.2 JP6.1
TRIG4  (via drill 0.6)  (1 unrouted)
  Top 0.406: R42.1 39.84,1.27 T11.3 39.2,1.27 37.47,1.27 36.83,1.91 JP7.1 | v20.64,22.86 20.46,22.86
  Top 0.61: 20.46,22.86 T12.1
  Bottom 0.406: JP8.1 34.93,22.86
  Bottom 0.61: 34.93,22.86 33.34,24.45 29.21,24.45 27.62,22.86 v20.64,22.86
V+  (via drill 0.6)  (2 unrouted)
  Top 0.406: 18.25,35.71 T9.3 18.25,35.56 | 18.25,21.59 T12.3
  Top 0.61: JP9.2 3.81,14.61 4.45,15.24 6.98,15.24 7.3,14.93 R50.2 9.21,11.43 IC2.1 12.06,11.43 v14.61,8.89 | v15.88,36.2 16.51,36.2 17.14,35.56 18.25,35.56 | JP12.3 54.61,27.3 57.15,29.84 v68.58,29.84 | T6.3 73.51,24.91 v72.39,26.04 | v72.39,34.93 72.39,35.56 74.3,37.47 74.76,37.47 T3.3 | v16.83,21.91 17.14,21.59 18.25,21.59
  Bottom 0.61: v15.88,36.2 8.89,36.2 5.08,32.39 5.08,31.11 JP10.2 5.08,28.57 5.08,27.94 9.53,23.49 15.24,23.49 v16.83,21.91 | v14.61,8.89 15.24,8.26 29.21,8.26 30.16,9.21 38.74,9.21 40.96,6.99 JP11.3 | v72.39,26.04 v68.58,29.84 72.39,33.66 v72.39,34.93

### Text on the board
tPlace: ENVCA v0.2 | ENVCA v0.2